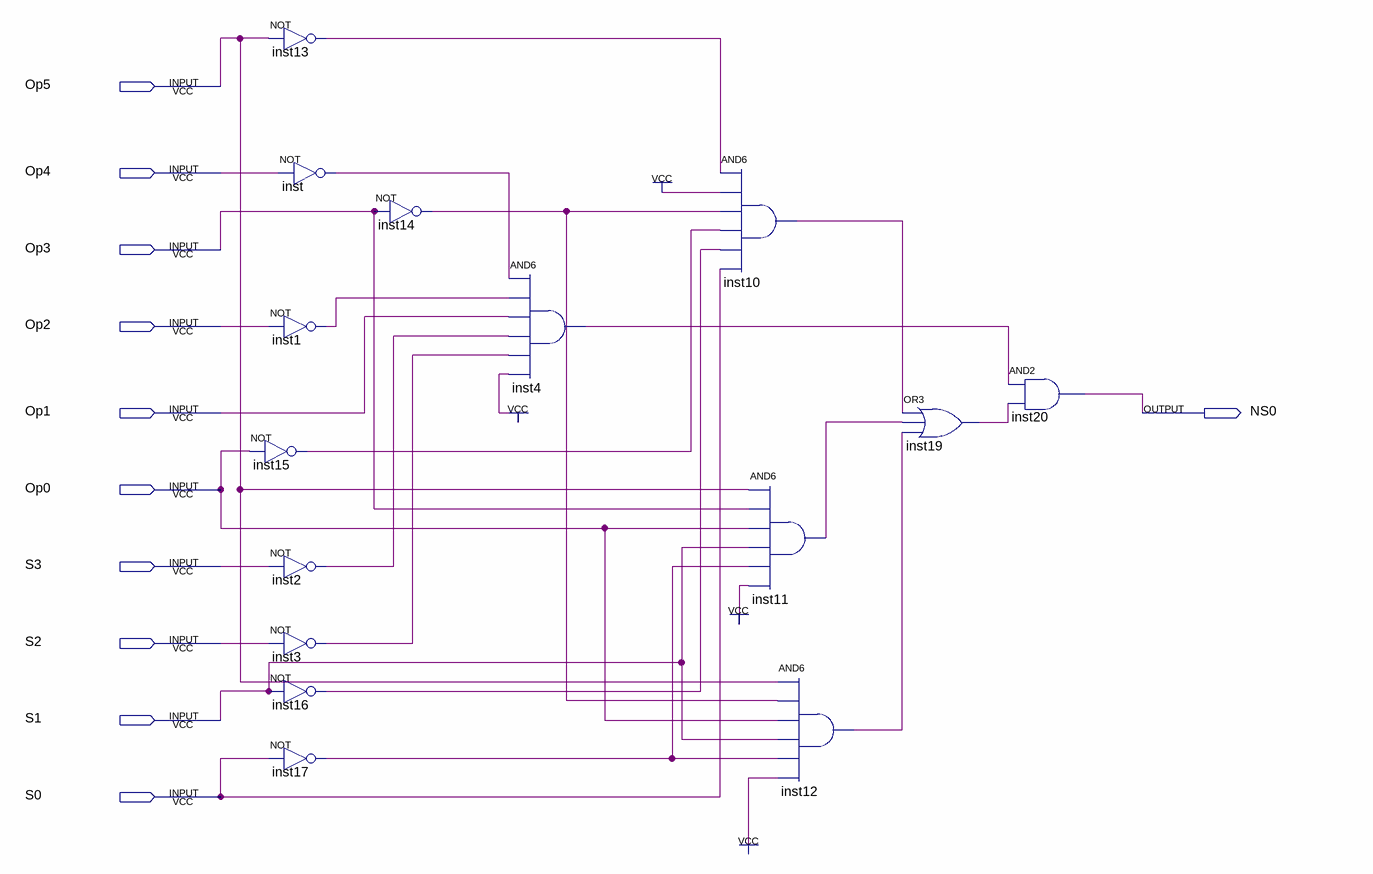
[diagram p0: schematic sheet]
// Quartus schematic NS0.bdf as structural Verilog: 15 symbols, 11 pins
module NS0 (
  input  Op5,
  input  Op4,
  input  Op3,
  input  Op2,
  input  Op1,
  input  Op0,
  input  S3,
  input  S2,
  input  S1,
  input  S0,
  output NS0
);

  wire inst1_out, inst2_out, inst3_out, inst4_out, inst10_out, inst11_out, inst12_out, inst13_out,
       inst14_out, inst15_out, inst16_out, inst17_out, inst19_out, inst_out;

  not inst13 (inst13_out, Op5);
  not inst (inst_out, Op4);
  not inst1 (inst1_out, Op2);
  not inst15 (inst15_out, Op0);
  not inst2 (inst2_out, S3);
  not inst3 (inst3_out, S2);
  not inst16 (inst16_out, S1);
  not inst17 (inst17_out, S0);
  not inst14 (inst14_out, Op3);
  and inst4 (inst4_out, inst_out, inst1_out, Op1, inst2_out, inst3_out, 1'b1);
  and inst10 (inst10_out, inst13_out, 1'b1, inst14_out, inst15_out, inst16_out, S0);
  and inst11 (inst11_out, Op5, Op3, Op0, S1, inst17_out, 1'b1);
  and inst12 (inst12_out, Op5, inst14_out, Op0, S1, inst17_out, 1'b1);
  or inst19 (inst19_out, inst10_out, inst11_out, inst12_out);
  and inst20 (NS0, inst4_out, inst19_out);
endmodule
